# Altium schematic sheet Amp.SchDoc
size A4
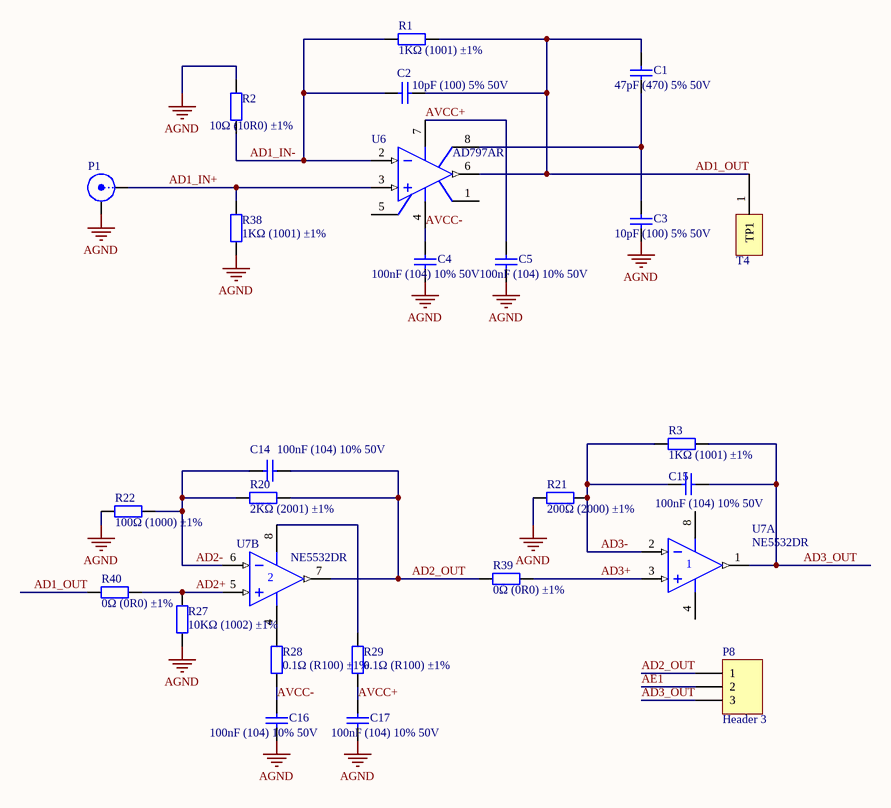
[diagram p0: Amp.SchDoc]

## Parts
C1  47pF (470) 5% 50V  [0603_C]
C2  10pF (100) 5% 50V  [0603_C]
C3  10pF (100) 5% 50V  [0603_C]
C4  100nF (104) 10% 50V  [0603_C]
C5  100nF (104) 10% 50V  [0603_C]
C14  100nF (104) 10% 50V  [0603_C]
C15  100nF (104) 10% 50V  [0603_C]
C16  100nF (104) 10% 50V  [0603_C]
C17  100nF (104) 10% 50V  [0603_C]
P1  SMB  [SMB_V-RJ45]  (value not drawn)
P8  Header 3  [HDR1X3]
R1  1KΩ (1001) ±1%  [0603_R]
R2  10Ω (10R0) ±1%  [0603_R]
R3  1KΩ (1001) ±1%  [0603_R]
R20  2KΩ (2001) ±1%  [0603_R]
R21  200Ω (2000) ±1%  [0603_R]
R22  100Ω (1000) ±1%  [0603_R]
R27  10KΩ (1002) ±1%  [0603_R]
R28  0.1Ω (R100) ±1%  [1206_R]
R29  0.1Ω (R100) ±1%  [1206_R]
R38  1KΩ (1001) ±1%  [0603_R]
R39  0Ω (0R0) ±1%  [0603_R]
R40  0Ω (0R0) ±1%  [0603_R]
T4  TP1  [TP1]  (value not drawn)
U6  AD797AR  [SO-8C_N]
U7  NE5532DR  [SOIC-8_150mil]  (parts A,B of 2)

## Nets
AGND: C3.1 C4.1 C5.1 C16.1 C17.1 P1.2(Y) R2.2 R21.1 R22.1 R27.1 R38.1
AD1_IN+: P1.1(X) R38.2 U6.3(IN+)
AD1_IN-: C2.2 R1.2 R2.1 U6.2(IN-)
AD1_OUT: C1.2 C2.1 R1.1 R40.1 T4.1(TP1) U6.6(OUT)
AD2+: R27.2 R40.2 U7.5(IN+)
AD2-: C14.1 R20.1 R22.2 U7.6(IN-)
AD2_OUT: C14.2 P8.1 R20.2 R39.1 U7.7(OUT)
AD3+: R39.2 U7.3(IN+)
AD3-: C15.1 R3.1 R21.2 U7.2(IN-)
AD3_OUT: C15.2 P8.3 R3.2 U7.1(OUT)
AE1: P8.2
AVCC+: C5.2 C17.2 R29.1 U6.7(V+)
AVCC-: C4.2 C16.2 R28.1 U6.4(V-)
NetC1_1: C1.1 C3.2 U6.8(DECMPEN)
NetR28_2: R28.2 U7.4(V-)
NetR29_2: R29.2 U7.8(V+)

Not connected (* = marked no-connect by the designer): U6 1(OS_NUL) 5(OS_NUL)

## Library data of the parts
C1 = 0603 47pF (470) 5% 50V: 贴片电容; ComponentLink1Description: 供应商链接; ComponentLink1URL: http://www.szlcsc.com/product/details_2023.html; Package: 0603; Supplier: LC; SuppliersPartNumber: C1671
C2 C3 = 0603 10pF (100) 5% 50V: 贴片电容; ComponentLink1Description: 供应商链接; ComponentLink1URL: http://www.szlcsc.com/product/details_1986.html; Package: 0603; Supplier: LC; SuppliersPartNumber: C1634
C4 C5 C14-C17 = 0603 100nF (104) 10% 50V: 贴片电容; ComponentLink1Description: 供应商链接; ComponentLink1URL: http://www.szlcsc.com/product/details_15331.html; Package: 0603; Supplier: LC; SuppliersPartNumber: C14663
P1 = SMB: SMB Straight Connector; LatestRevisionDate: 17-Jul-2002; LatestRevisionNote: Re-released for DXP Platform.; Publisher: Altium Limited
P8 = Header 3: Header, 3-Pin; LatestRevisionDate: 17-Jul-2002; LatestRevisionNote: Re-released for DXP Platform.; Publisher: Altium Limited
R1 R3 R38 = 0603 1KΩ (1001) 1%: 贴片电阻; ComponentLink1Description: 供应商链接; ComponentLink1URL: http://www.szlcsc.com/product/details_21904.html; Package: 0603; Supplier: LC; SuppliersPartNumber: C21190
R2 = 0603 10Ω (10R0) 1%: 贴片电阻; ComponentLink1Description: 供应商链接; ComponentLink1URL: http://www.szlcsc.com/product/details_23586.html; Package: 0603; Supplier: LC; SuppliersPartNumber: C22859
R20 = 0603 2KΩ (2001) 1%: 贴片电阻; ComponentLink1Description: 供应商链接; ComponentLink1URL: http://www.szlcsc.com/product/details_23702.html; Package: 0603; Supplier: LC; SuppliersPartNumber: C22975
R21 = 0603 200Ω (2000) 1%: 贴片电阻; ComponentLink1Description: 供应商链接; ComponentLink1URL: http://www.szlcsc.com/product/details_8708.html; Package: 0603; Supplier: LC; SuppliersPartNumber: C8218
R22 = 0603 100Ω (1000) 1%: 贴片电阻; ComponentLink1Description: 供应商链接; ComponentLink1URL: http://www.szlcsc.com/product/details_23502.html; Package: 0603; Supplier: LC; SuppliersPartNumber: C22775
R27 = 0603 10KΩ (1002) 1%: 贴片电阻; ComponentLink1Description: 供应商链接; ComponentLink1URL: http://www.szlcsc.com/product/details_26547.html; Package: 0603; Supplier: LC; SuppliersPartNumber: C25804
R28 R29 = 1206 0.1Ω (R100) 1%: 贴片电阻; ComponentLink1Description: 供应商链接; ComponentLink1URL: http://www.szlcsc.com/product/details_26077.html; Package: 1206; Supplier: LC; SuppliersPartNumber: C25334
R39 R40 = 0603 0Ω (0R0) 1%: 贴片电阻; ComponentLink1Description: 供应商链接; ComponentLink1URL: http://www.szlcsc.com/product/details_21903.html; Package: 0603; Supplier: LC; SuppliersPartNumber: C21189
U6 = AD797AR: Ultra-Low Distortion, Ultra-Low Noise Operational Amplifier; Published: 8-Jun-2000; LatestRevisionDate: 13-Apr-2006; LatestRevisionNote: IPC-7351 Footprint Added.; DatasheetVersion: REV. C; PackageVersion: revC; PackageReference: SO-8C; Publisher: Altium Limited; PackageDescription: 8-Pin Small Outline Integrated Circuit 1.27 mm Pitch; Code_IPC: SOIC127P600-8; ComponentLink1Description: Manufacturer Link; ComponentLink1URL: http://www.analog.com/en/prod/0,,759_786_AD797%2C00.html; ComponentLink2Description: Datasheet; ComponentLink2URL: http://www.analog.com/UploadedFiles/Data_Sheets/507345751AD797_d.pdf
U7 = NE5532DR_[C7426]: 功放; ComponentLink1Description: 供应商链接; ComponentLink1URL: http://www.szlcsc.com/product/details_7903.html; Package: SOIC-8_150mil; Supplier: LC; SuppliersPartNumber: C7426